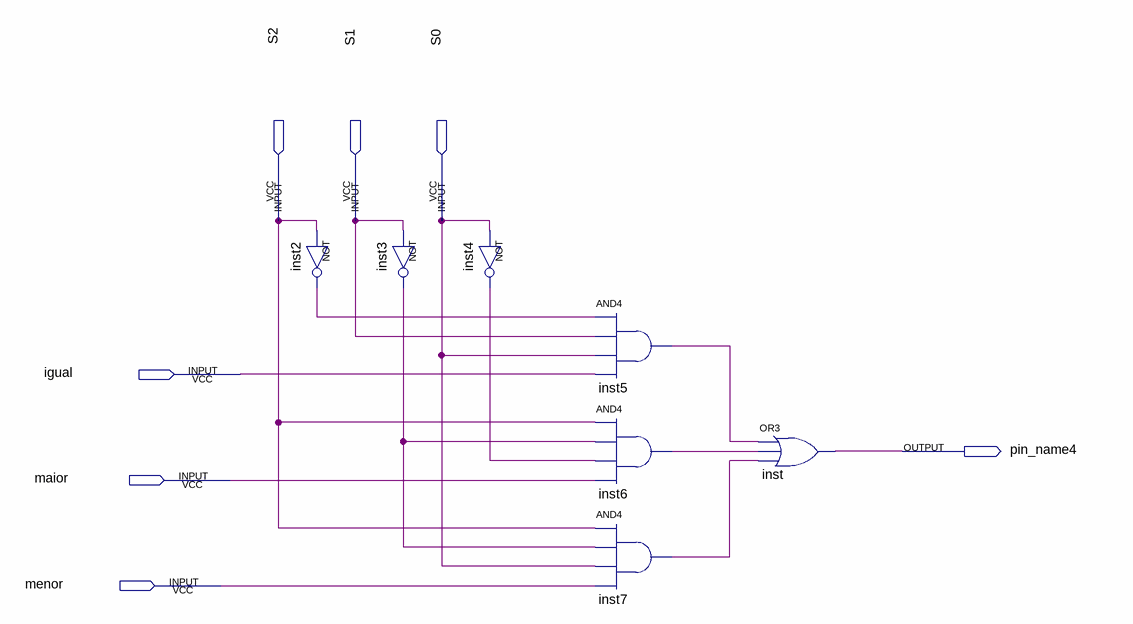
[diagram p0: schematic sheet]
// Quartus schematic MUX_3p1.bdf as structural Verilog: 7 symbols, 7 pins
module MUX_3p1 (
  input  S2,
  input  S1,
  input  S0,
  input  igual,
  input  maior,
  input  menor,
  output pin_name4
);

  wire inst2_out, inst3_out, inst4_out, inst5_out, inst6_out, inst7_out;

  not inst2 (inst2_out, S2);
  not inst3 (inst3_out, S1);
  not inst4 (inst4_out, S0);
  and inst5 (inst5_out, inst2_out, S1, S0, igual);
  and inst6 (inst6_out, S2, inst3_out, inst4_out, maior);
  and inst7 (inst7_out, S2, inst3_out, S0, menor);
  or inst (pin_name4, inst5_out, inst6_out, inst7_out);
endmodule
